# Altium schematic sheet PWR_0V9_20A.SchDoc: =ProjectName
size 420 x 297 mm; Author: T.P.; CompanyName: WUT; DrawnBy: T.P.; Organization: WUT ISE; Address1: Warsaw Univeristy of Technology; Address2: Nowowiejska 15/19; DocumentNumber: 28; Revision: 0.9; SheetNumber: 28; SheetTotal: 36; EDA_Number: ARTIQ; Projet: ARTIQ/SINARA; ModifiedBy: -; CreateDate: XX/XX/XXXX; CheckedDate: -; Title2: PWR_0V9_20A.SchDoc; DivGrp: ISE; Designer: G.K. and T.P.; ModifiedDate: -; ProjectName: ADC/DAC MEZZANINE
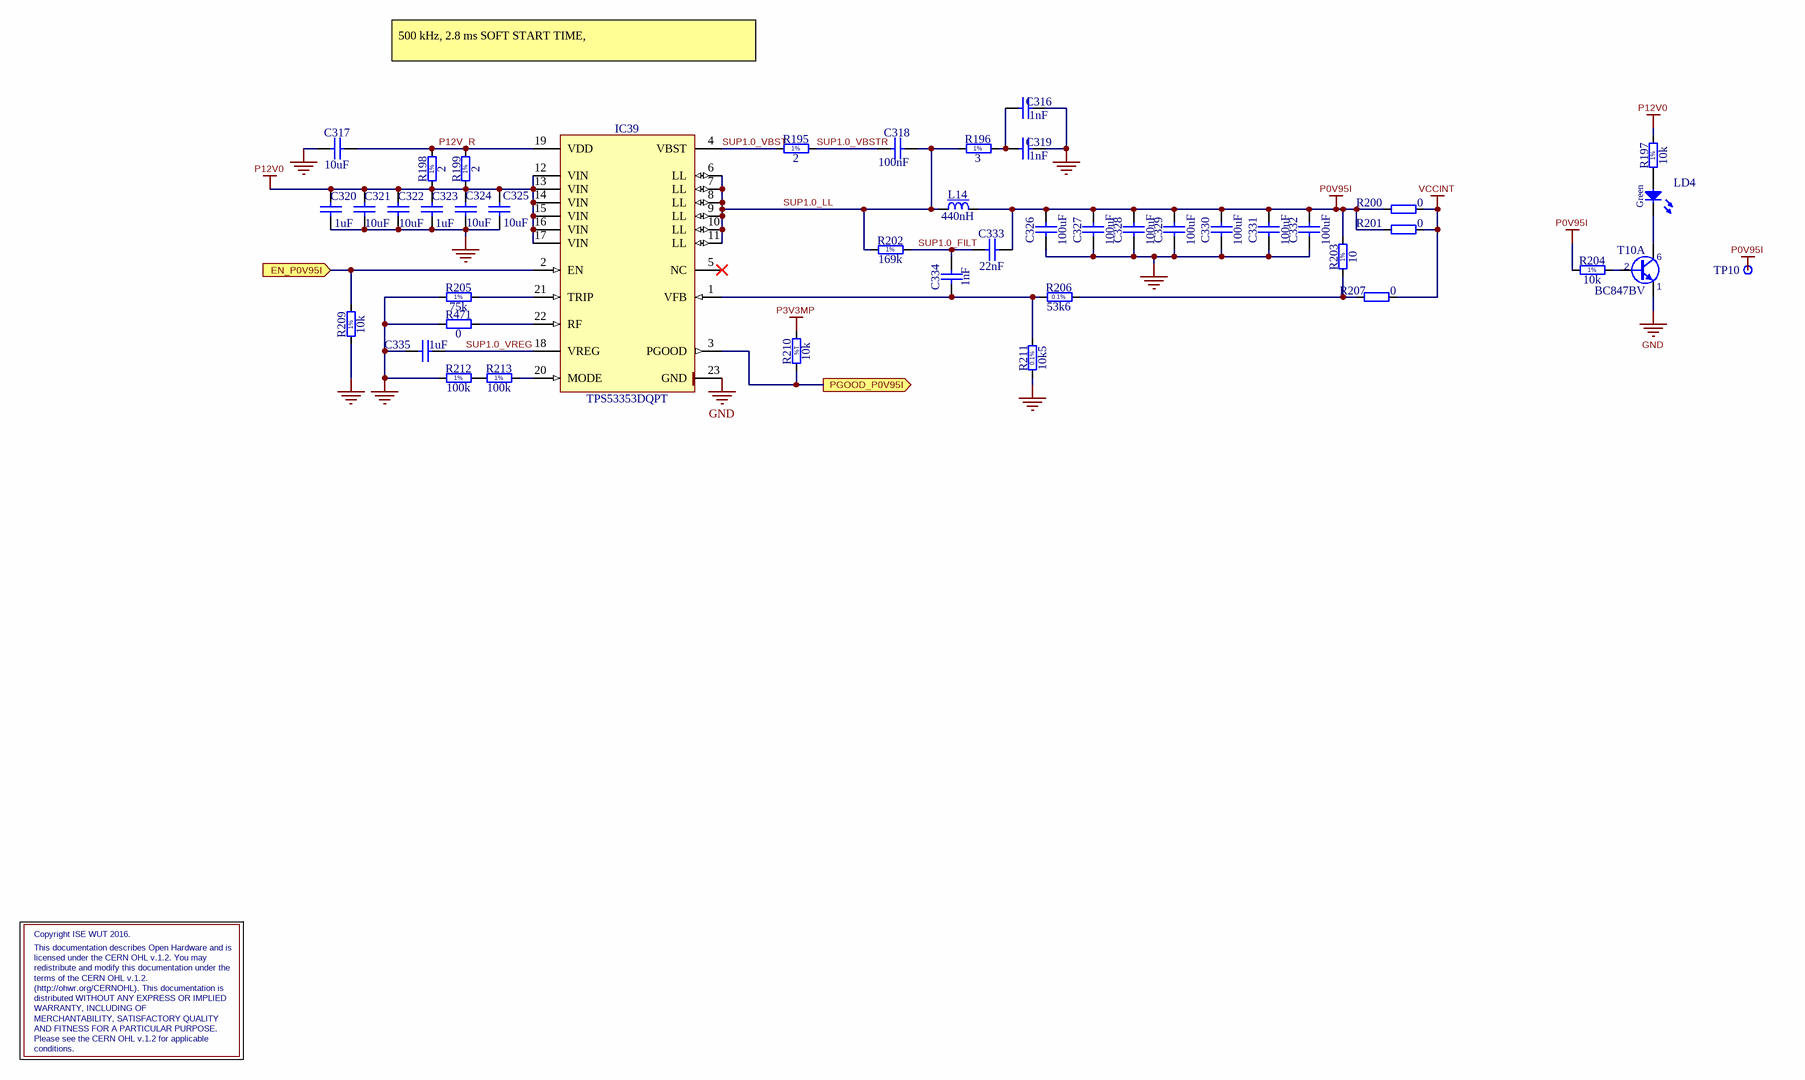
[diagram p0: PWR_0V9_20A.SchDoc]

## Parts
C316  1nF  [CAPC1005X55N]
C317  10uF  [CAPC3216X180N]
C318  100nF  [CAPC1005X55N]
C319  1nF  [CAPC1005X55N]
C320  1uF  [CAPC1608X87N]
C321  10uF  [CAPC3216X180N]
C322  10uF  [CAPC3216X180N]
C323  1uF  [CAPC1608X87N]
C324  10uF  [CAPC3216X180N]
C325  10uF  [CAPC3216X180N]
C326  100uF  [CAPC3216X180N]
C327  100uF  [CAPC3216X180N]
C328  100uF  [CAPC3216X180N]
C329  100uF  [CAPC3216X180N]
C330  100uF  [CAPC3216X180N]
C331  100uF  [CAPC3216X180N]
C332  100uF  [CAPC3216X180N]
C333  22nF  [CAPC1608X87N]
C334  1nF  [CAPC1005X55N]
C335  1uF  [CAPC1608X87N]
IC39  TPS53353DQPT  [SON50P500X600X150-23N-R334X557]
L14  440nH  [IND_PULSE_PA0513]
LD4  Green  [LED_OSRAM_LGL29K]
R195  2  [RESC1608X55N]
R196  3  [RESC3216X65N]
R197  10k  [RESC1005X40N]
R198  2  [RESC1608X55N]
R199  2  [RESC1608X55N]
R200  0  [RESC6331X70N]
R201  0  [RESC6331X70N]
R202  169k  [RESC1608X55N]
R203  10  [RESC1005X40N]
R204  10k  [RESC1005X40N]
R205  75k  [RESC1005X40N]
R206  53k6  [RESC1608X55N]
R207  0  [RESC6331X70N]
R209  10k  [RESC1005X40N]
R210  10k  [RESC1005X40N]
R211  10k5  [RESC1608X55N]
R212  100k  [RESC1005X40N]
R213  100k  [RESC1005X40N]
R471  0  [RESC1005X40N]
T10  BC847BV  [SOTFL50P160X60-6N]  (part A of 2)
TP10  Test Point  [TPS127]  (value not drawn)

## Ports
EN_P0V95I (in), PGOOD_P0V95I (out)

## Nets
GND: C316.2 C317.2 C319.2 C320.1 C321.1 C322.1 C323.1 C324.1 C325.1 C326.1 C327.1 C328.1 C329.1 C330.1 C331.1 C332.1 C335.2 IC39.23(GND) R205.1 R209.2 R211.1 R212.1 R471.1 T10.1(E)
P0V95I: C326.2 C327.2 C328.2 C329.2 C330.2 C331.2 C332.2 C333.2 L14.2 R200.1 R201.1 R203.2 R204.1 TP10.1
P3V3MP: R210.2
P12V0: C320.2 C321.2 C322.2 C323.2 C324.2 C325.2 IC39.12(VIN) IC39.13(VIN) IC39.14(VIN) IC39.15(VIN) IC39.16(VIN) IC39.17(VIN) R197.2 R198.1 R199.1
VCCINT: R200.2 R201.2 R207.2
EN_P0V95I: IC39.2(EN) R209.1 ; port EN_P0V95I
P12V_R: C317.1 IC39.19(VDD) R198.2 R199.2
PGOOD_P0V95I: IC39.3(PGOOD) R210.1 ; port PGOOD_P0V95I
SUP1.0_FILT: C333.1 C334.2 R202.2
SUP1.0_LL: C318.2 IC39.6(LL) IC39.7(LL) IC39.8(LL) IC39.9(LL) IC39.10(LL) IC39.11(LL) L14.1 R196.1 R202.1
SUP1.0_VBST: IC39.4(VBST) R195.1
SUP1.0_VBSTR: C318.1 R195.2
SUP1.0_VREG: C335.1 IC39.18(VREG)
NetC316_1: C316.1 C319.1 R196.2
NetC334_1: C334.1 IC39.1(VFB) R206.1 R211.2
NetIC39_20: IC39.20(MODE) R213.2
NetIC39_21: IC39.21(TRIP) R205.2
NetIC39_22: IC39.22(RF) R471.2
NetLD4_1: LD4.1(C) T10.6(C)
NetLD4_2: LD4.2(A) R197.1
NetR203_1: R203.1 R206.2 R207.1
NetR204_2: R204.2 T10.2(B)
NetR212_2: R212.2 R213.1

Not connected (* = marked no-connect by the designer): IC39 5(NC)*

## Notes on the sheet
- 500 kHz, 2.8 ms SOFT START TIME,
- Copyright ISE WUT 2016.
- (http://ohwr.org/CERNOHL). This documentation is
- distributed WITHOUT ANY EXPRESS OR IMPLIED
- This documentation describes Open Hardware and is
- terms of the CERN OHL v.1.2.
- licensed under the CERN OHL v.1.2. You may
- redistribute and modify this documentation under the
- conditions.
- AND FITNESS FOR A PARTICULAR PURPOSE.
- MERCHANTABILITY, SATISFACTORY QUALITY
- Please see the CERN OHL v.1.2 for applicable
- WARRANTY, INCLUDING OF
- Project/Equipment
- Document
- Designer
- Drawn by
- Check.by
- File
- Last Mod.
- Print Date
- Sheet
- Size
- A3
- of
- Rev
- (in symbol R0402_10K_1%_0.0625W_100PPM) 1%
- (in symbol R0402_10R_1%_0.0625W_200PPM) 1%
- (in symbol R0402_75K_1%_0.0625W_100PPM) 1%
- (in symbol R0402_100K_1%_0.0625W_100PPM) 1%
- (in symbol R0603_2R_1%_0.1W_200PPM) 1%
- (in symbol R0603_10K5_0.1%_0.063W_10PPM) 0.1%
- (in symbol R0603_53K6_0.1%_0.063W_10PPM) 0.1%
- (in symbol R0603_169K_1%_0.1W_100PPM) 1%
- (in symbol R1206_3R_1%_0.25W_200PPM) 1%

## Library data of the parts
C316 C319 C334 = CC0402_1NF_50V_10%_X7R: Non-polarised capacitor; Manufacturer: GENERIC; Part Description: SMD Multilayer Chip Ceramic Capacitor; Manufacturer1 Part Number: 223858715623; Tolerance: ±10%; Voltage: 50V; TC: X7R; Manufacturer Part Number: CC0402_1NF_50V_10%_X7R; Part Number: CC0402_1NF_50V_10%_X7R; Value: 1nF; Component Kind: Standard; Component Type: Standard; Pin Count: 2; Status: Not Recommended; Case: 0402; Mounted: Yes; Socket: No; SMD: Yes; Sense: No; Manufacturer1 Example: PHYCOMP; Manufacturer1 ComponentHeight: 0.55mm; HelpURL: \\cern.ch\dfs\Applications\Altium\Datasheets\CC0402_X7R_PHYCOMP.pdf; Author: CERN DEM JLC; CreateDate: 03.12.2007; LatestRevisionDate: 03.12.2007
C317 C321 C322 C324 C325 = CC1206_10uF_25V_10%_X7R: Non-polarised capacitor; Manufacturer: GENERIC; Part Description: SMD Multilayer Chip Ceramic Capacitor; Manufacturer1 Part Number: C1206C106K4RACTU; Tolerance: ±10%; Voltage: 25V; TC: X7R; Manufacturer Part Number: CC1206_10uF_25V_10%_X7R; Part Number: CC1206_10UF_25V_10%_X7R; Value: 10uF; Component Kind: Standard; Component Type: Standard; Pin Count: 2; Status: Preferred; Case: 1206; Mounted: Yes; Socket: No; SMD: Yes; Sense: No; Manufacturer1 Example: KEMET; Manufacturer1 ComponentHeight: 1.8mm; HelpURL: \\cern.ch\dfs\Applications\Altium\Datasheets\CC1206_X7R_KEMET.pdf; Author: CERN DEM JLC; CreateDate: 12.09.2012; LatestRevisionDate: 12.09.2012
C318 = CC0402_100NF_16V_10%_X5R: Non-polarised capacitor; Manufacturer: GENERIC; Part Description: SMD Multilayer Chip Ceramic Capacitor; Manufacturer1 Part Number: GRM155R61C104KA88D; Tolerance: ±10%; Voltage: 16V; TC: X5R; Manufacturer Part Number: CC0402_100NF_16V_10%_X5R; Part Number: CC0402_100NF_16V_10%_X5R; Value: 100nF; Component Kind: Standard; Component Type: Standard; Pin Count: 2; Status: None; Case: 0402; Mounted: Yes; Socket: No; SMD: Yes; Sense: No; Manufacturer1 Example: MURATA; Manufacturer1 ComponentHeight: 0.55mm; HelpURL: \\cern.ch\dfs\Applications\Altium\Datasheets\CC0402_X5R_MURATA_GRM.pdf; Author: CERN DEM JLC; CreateDate: 10.12.2013; LatestRevisionDate: 10.12.2013
C320 C323 C335 = CC0603_1UF_25V_10%_X7R: Non-polarised capacitor; Manufacturer: GENERIC; Part Description: SMD Multilayer Chip Ceramic Capacitor; Manufacturer1 Part Number: GRM188R71E105KA12D; Tolerance: ±10%; Voltage: 25V; TC: X7R; Manufacturer Part Number: CC0603_1UF_25V_10%_X7R; Part Number: CC0603_1UF_25V_10%_X7R; Value: 1uF; Component Kind: Standard; Component Type: Standard; Pin Count: 2; Status: None; Case: 0603; Mounted: Yes; Socket: No; SMD: Yes; Sense: No; Manufacturer1 Example: MURATA; Manufacturer1 ComponentHeight: 0.9mm; HelpURL: \\cern.ch\dfs\Applications\Altium\Datasheets\CC0603_X7R_MURATA.pdf; Author: CERN DEM JLC; CreateDate: 18.01.2011; LatestRevisionDate: 18.01.2011
C326-C332 = CC1206_100UF_6.3V_20%_X5R: Non-polarised capacitor; Manufacturer: GENERIC; Part Description: SMD Multilayer Chip Ceramic Capacitor; Manufacturer1 Part Number: C1206C107M9PACTU; Tolerance: ±10%; Voltage: 6.3V; TC: X5R; Manufacturer Part Number: CC1206_100UF_6.3V_20%_X5R; Part Number: CC1206_100UF_6.3V_20%_X5R; Value: 100uF; Component Kind: Standard; Component Type: Standard; Pin Count: 2; Status: None; Case: 1206; Mounted: Yes; Socket: No; SMD: Yes; Sense: No; Manufacturer1 Example: KEMET; Manufacturer1 ComponentHeight: 1.8mm; HelpURL: \\cern.ch\dfs\Applications\Altium\Datasheets\CC1206_X5R_KEMET.pdf; Author: CERN DEM JLC; CreateDate: 26.09.2012; LatestRevisionDate: 26.09.2012
C333 = CC0603_22NF_50V_10%_X7R: Non-polarised capacitor; Manufacturer: GENERIC; Part Description: SMD Multilayer Chip Ceramic Capacitor; Manufacturer1 Part Number: 223858615641; Tolerance: ±10%; Voltage: 50V; TC: X7R; Manufacturer Part Number: CC0603_22NF_50V_10%_X7R; Part Number: CC0603_22NF_50V_10%_X7R; Value: 22nF; Component Kind: Standard; Component Type: Standard; Pin Count: 2; Status: Preferred; Case: 0603; Mounted: Yes; Socket: No; SMD: Yes; Sense: No; Manufacturer1 Example: PHYCOMP; Manufacturer1 ComponentHeight: 0.87mm; HelpURL: \\cern.ch\dfs\Applications\Altium\Datasheets\CC0603_X7R_PHYCOMP.pdf; Author: CERN DEM JLC; CreateDate: 03.12.2007; LatestRevisionDate: 03.12.2007
IC39 = TPS53353DQPT: 1.5V to 15V Input (4.5V to 25V Bias), 20A Synchronous Buck SWIFT™ Converter with Eco-mode™; Manufacturer: TEXAS INSTRUMENTS; Autho: TP; PressFit: No; Bonding: No; Mounted: Yes; Part Number: TPS53353DQPT; Pin Count: 23; Socket: No; Sense: No; SMD: Yes; Case: SON22; Component Kind: Standard; Component Type: Standard; ComponentHeight: 1.5mm; CreateDate: 17.01.2019; Device: TPS53353DQPT; Manufacturer Part Number: TPS53353DQPT; PackageDescription: SON, 0.50mm Pitch; 22 Pin, 5.00mm W X 6.00mm L X 1.50mm H Body (w/Thermal Tab 3.34 X 5.57mm), IPC Medium Density; Part Description: 1.5V to 15V Input (4.5V to 25V Bias), 20A Synchronous Buck SWIFT™ Converter with Eco-mode™
L14 = IND_440NH_20%_PULSE_PA0513.441NLT: Inductor With Core; Manufacturer: PULSE ELECTRONICS; Part Description: SMT Power Inductor; Tolerance: ±20%; Power: 30A; Resistance: 0.0032R; Manufacturer Part Number: PA0513.441NLT; Part Number: IND_440NH_20%_PULSE_PA0513.441NLT; Value: 440nH; Component Kind: Standard; Component Type: Standard; Pin Count: 2; Status: None; Mounted: Yes; Socket: No; SMD: Yes; Sense: No; ComponentHeight: 8mm; HelpURL: \\cern.ch\dfs\Applications\Altium\Datasheets\IND_PULSE_PA0513.441NLT.pdf; Author: CERN DEM JLC; CreateDate: 15.11.2016; LatestRevisionDate: 15.11.2016
LD4 = LED_OSRAM_LG L29K-G2J1-24-Z: LED Green 1C 2A; Manufacturer: OSRAM; Part Description: Surface Mount Green LED (0603 Case); Bonding: No; PressFit: No; Status Comment: Sourcing Difficulty; Author: CERN DEM JLC; Case: 0603; Color: Green; Component Kind: Standard; Component Type: Standard; ComponentHeight: 0.67mm; CreateDate: 24.04.2012; HelpURL: \\cern.ch\dfs\Applications\Altium\Datasheets\LED_OSRAM_LGL29K.pdf; LatestRevisionDate: 24.04.2012; Manufacturer Part Number: LG L29K-G2J1-24-Z; Mounted: Yes; PackageDescription: Green Chip LED, 2-Leads, Body 1.7x0.8mm, IPC Medium Density; Part Number: LED_OSRAM_LG L29K-G2J1-24-Z; Pin Count: 2; SMD: Yes; Socket: No; Status: Not Recommended; Sense: No
R195 R198 R199 = R0603_2R_1%_0.1W_200PPM: Resistor - 1%; Manufacturer: GENERIC; Part Description: General Purpose Thick Film Chip Resistor; Manufacturer1 Part Number: 232270462008L or RC0603FR-072RL; Power: 0.1W; TC: ±200ppm/°C; PressFit: No; Manufacturer Part Number: R0603_2R_1%_0.1W_200PPM; Part Number: R0603_2R_1%_0.1W_200PPM; Tolerance: ±1%; Value: 2; Component Kind: Standard; Component Type: Standard; Pin Count: 2; Status: Preferred; Case: 0603; Mounted: Yes; Sense: No; Socket: No; SMD: Yes; Manufacturer1 Example: YAGEO PHYCOMP; Manufacturer1 ComponentHeight: 0.65mm; HelpURL: \\cern.ch\dfs\Applications\Altium\Datasheets\R0603_Tyco_RN73.pdf; Author: CERN DEM JLC; CreateDate: 03.12.2007; LatestRevisionDate: 17.10.2012
R196 = R1206_3R_1%_0.25W_200PPM: Resistor - 1%; Manufacturer: GENERIC; Part Description: General Purpose Thick Film Chip Resistor; Manufacturer1 Part Number: 232272463008; Power: 0.25W; TC: ±200ppm/°C; PressFit: No; Manufacturer Part Number: R1206_3R_1%_0.25W_200PPM; Part Number: R1206_3R_1%_0.25W_200PPM; Tolerance: ±1%; Value: 3; Component Kind: Standard; Component Type: Standard; Pin Count: 2; Status: Preferred; Case: 1206; Mounted: Yes; Sense: No; Socket: No; SMD: Yes; Manufacturer1 Example: PHYCOMP; Manufacturer1 ComponentHeight: 0.65mm; HelpURL: \\cern.ch\dfs\Applications\Altium\Datasheets\R1206_Phycomp_RC1206.pdf; Author: CERN DEM JLC; CreateDate: 03.12.2007; LatestRevisionDate: 24.06.2009
R197 = R0402_10K_1%_0.0625W_100PPM: Resistor - 1%; Part Description: General Purpose Thick Film Chip Resistor; Manufacturer: GENERIC; Manufacturer1 Part Number: 232270671003L; TC: ±100ppm/°C; PressFit: No; Part Number: R0402_10K_1%_0.0625W_100PPM; Component Kind: Standard; Component Type: Standard; Pin Count: 2; Value: 10k; Status: Not Recommended; Power: 0.0625W; Tolerance: ±1%; Manufacturer Part Number: R0402_10K_1%_0.0625W_100PPM; Case: 0402; Mounted: Yes; Sense: No; Socket: No; SMD: Yes; Manufacturer1 Example: YAGEO PHYCOMP; Manufacturer1 ComponentHeight: 0.4mm; HelpURL: \\cern.ch\dfs\Applications\Altium\Datasheets\R0402_Phycomp_RC0402.pdf; Author: CERN DEM JLC; CreateDate: 03.12.2007; LatestRevisionDate: 17.10.2012
R200 R201 R207 = R2512_0R_JUMPER: Resistor; Manufacturer: GENERIC; Part Description: 16A (0.005R Max DC Resistance) Zero Ohm Jumper; Manufacturer1 Part Number: CRCW25120000Z0EG; PressFit: No; Manufacturer Part Number: R2512_0R_JUMPER; Part Number: R2512_0R_JUMPER; Value: 0; Component Kind: Standard; Component Type: Standard; Pin Count: 2; Status: Preferred; Case: 2512; Mounted: Yes; Sense: No; Socket: No; SMD: Yes; Manufacturer1 Example: VISHAY DRALORIC; Manufacturer1 ComponentHeight: 0.7mm; HelpURL: \\cern.ch\dfs\Applications\Altium\Datasheets\R2512_VISHAY_CRCW-HP E3.pdf; Author: CERN DEM JLC; CreateDate: 17.09.2014; LatestRevisionDate: 17.09.2014
R202 = R0603_169K_1%_0.1W_100PPM: Resistor - 1%; Manufacturer: GENERIC; Part Description: General Purpose Thick Film Chip Resistor; Manufacturer1 Part Number: CRCW0603169KFKEA; Power: 0.1W; TC: ±100ppm/°C; PressFit: No; Manufacturer Part Number: R0603_169K_1%_0.1W_100PPM; Part Number: R0603_169k_1%_0.1W_100PPM; Tolerance: ±1%; Value: 169k; Component Kind: Standard; Component Type: Standard; Pin Count: 2; Status: Preferred; Case: 0603; Mounted: Yes; Sense: No; Socket: No; SMD: Yes; Manufacturer1 Example: VISHAY; Manufacturer1 ComponentHeight: 0.50mm; HelpURL: \\cern.ch\dfs\Applications\Altium\Datasheets\R0603_VISHAY_CRCW e3.pdf; Author: CERN DEM JLC; CreateDate: 17.03.2014; LatestRevisionDate: 17.03.2014
R203 = R0402_10R_1%_0.0625W_200PPM: Resistor - 1%; Manufacturer: GENERIC; Part Description: General Purpose Thick Film Chip Resistor; Manufacturer1 Part Number: 232270671009L; TC: ±200ppm/°C; PressFit: No; Manufacturer Part Number: R0402_10R_1%_0.0625W_200PPM; Part Number: R0402_10R_1%_0.0625W_200PPM; Tolerance: ±1%; Value: 10; Component Kind: Standard; Component Type: Standard; Pin Count: 2; Status: Not Recommended; Power: 0.0625W; Case: 0402; Mounted: Yes; Sense: No; Socket: No; SMD: Yes; Manufacturer1 Example: YAGEO PHYCOMP; Manufacturer1 ComponentHeight: 0.4mm; HelpURL: \\cern.ch\dfs\Applications\Altium\Datasheets\R0402_Phycomp_RC0402.pdf; Author: CERN DEM JLC; CreateDate: 24.06.2009; LatestRevisionDate: 17.10.2012
R204 R209 R210 = R0402_10K_1%_0.0625W_100PPM: Resistor - 1%; Manufacturer: GENERIC; Part Description: General Purpose Thick Film Chip Resistor; Manufacturer1 Part Number: 232270671003L; TC: ±100ppm/°C; PressFit: No; Manufacturer Part Number: R0402_10K_1%_0.0625W_100PPM; Part Number: R0402_10K_1%_0.0625W_100PPM; Tolerance: ±1%; Value: 10k; Component Kind: Standard; Component Type: Standard; Pin Count: 2; Status: Not Recommended; Power: 0.0625W; Case: 0402; Mounted: Yes; Sense: No; Socket: No; SMD: Yes; Manufacturer1 Example: YAGEO PHYCOMP; Manufacturer1 ComponentHeight: 0.4mm; HelpURL: \\cern.ch\dfs\Applications\Altium\Datasheets\R0402_Phycomp_RC0402.pdf; Author: CERN DEM JLC; CreateDate: 03.12.2007; LatestRevisionDate: 17.10.2012
R205 = R0402_75K_1%_0.0625W_100PPM: Resistor - 1%; Manufacturer: GENERIC; Part Description: General Purpose Thick Film Chip Resistor; Manufacturer1 Part Number: 232270677503L; TC: ±100ppm/°C; PressFit: No; Manufacturer Part Number: R0402_75K_1%_0.0625W_100PPM; Part Number: R0402_75K_1%_0.0625W_100PPM; Tolerance: ±1%; Value: 75k; Component Kind: Standard; Component Type: Standard; Pin Count: 2; Status: Not Recommended; Power: 0.0625W; Case: 0402; Mounted: Yes; Sense: No; Socket: No; SMD: Yes; Manufacturer1 Example: YAGEO PHYCOMP; Manufacturer1 ComponentHeight: 0.4mm; HelpURL: \\cern.ch\dfs\Applications\Altium\Datasheets\R0402_Phycomp_RC0402.pdf; Author: CERN DEM JLC; CreateDate: 03.12.2007; LatestRevisionDate: 17.10.2012
R206 = R0603_53K6_0.1%_0.063W_10PPM: Resistor - 0.1%; Part Description: Thin Film Chip Resistor; Manufacturer: GENERIC; Manufacturer1 Part Number: RN73C1J53K6BTDF; Power: 0.063W; TC: ±10ppm; PressFit: No; Part Number: R0603_53K6_0.1%_0.063W_10PPM; Component Kind: Standard; Component Type: Standard; Pin Count: 2; Value: 53k6; Status: Not Recommended; Tolerance: ±0.1%; Manufacturer Part Number: R0603_53K6_0.1%_0.063W_10PPM; Case: 0603; Mounted: Yes; Sense: No; Socket: No; SMD: Yes; Manufacturer1 Example: TYCO HOLSWORTHY; Manufacturer1 ComponentHeight: 0.5mm; HelpURL: \\cern.ch\dfs\Applications\Altium\Datasheets\R0603_Tyco_RN73.pdf; Author: CERN DEM JLC; CreateDate: 03.12.2007; LatestRevisionDate: 13.03.2008
R211 = R0603_10K5_0.1%_0.063W_10PPM: Resistor - 0.1%; Part Description: Thin Film Chip Resistor; Manufacturer: GENERIC; Manufacturer1 Part Number: RN73C1J10K5BTDF; Power: 0.063W; TC: ±10ppm; PressFit: No; Part Number: R0603_10K5_0.1%_0.063W_10PPM; Component Kind: Standard; Component Type: Standard; Pin Count: 2; Value: 10k5; Status: Not Recommended; Tolerance: ±0.1%; Manufacturer Part Number: R0603_10K5_0.1%_0.063W_10PPM; Case: 0603; Mounted: Yes; Sense: No; Socket: No; SMD: Yes; Manufacturer1 Example: TYCO HOLSWORTHY; Manufacturer1 ComponentHeight: 0.5mm; HelpURL: \\cern.ch\dfs\Applications\Altium\Datasheets\R0603_Tyco_RN73.pdf; Author: CERN DEM JLC; CreateDate: 03.12.2007; LatestRevisionDate: 13.03.2008
R212 R213 = R0402_100K_1%_0.0625W_100PPM: Resistor - 1%; Manufacturer: GENERIC; Part Description: General Purpose Thick Film Chip Resistor; Manufacturer1 Part Number: 232270671004L; TC: ±100ppm/°C; PressFit: No; Manufacturer Part Number: R0402_100K_1%_0.0625W_100PPM; Part Number: R0402_100K_1%_0.0625W_100PPM; Tolerance: ±1%; Value: 100k; Component Kind: Standard; Component Type: Standard; Pin Count: 2; Status: Not Recommended; Power: 0.0625W; Case: 0402; Mounted: Yes; Sense: No; Socket: No; SMD: Yes; Manufacturer1 Example: YAGEO PHYCOMP; Manufacturer1 ComponentHeight: 0.4mm; HelpURL: \\cern.ch\dfs\Applications\Altium\Datasheets\R0402_Phycomp_RC0402.pdf; Author: CERN DEM JLC; CreateDate: 03.12.2007; LatestRevisionDate: 17.10.2012
R471 = R0402_0R_JUMPER: Resistor; Part Description: 1A (0.05R Max DC Resistance) Zero Ohm Jumper; Manufacturer: GENERIC; Manufacturer1 Part Number: 232270591001L; PressFit: No; Part Number: R0402_0R_JUMPER; Component Kind: Standard; Component Type: Standard; Pin Count: 2; Value: 0; Status: Not Recommended; Manufacturer Part Number: R0402_0R_JUMPER; Case: 0402; Mounted: Yes; Sense: No; Socket: No; SMD: Yes; Manufacturer1 Example: YAGEO PHYCOMP; Manufacturer1 ComponentHeight: 0.4mm; HelpURL: \\cern.ch\dfs\Applications\Altium\Datasheets\R0402_Phycomp_RC0402.pdf; Author: CERN DEM JLC; CreateDate: 03.12.2007; LatestRevisionDate: 17.10.2012
T10 = BC847BV: 45V, 100mA NPN General Purpose Double Transistor; Manufacturer: NXP SEMICONDUCTORS; Part Description: 45V 100mA NPN General Purpose Double Transistor; PressFit: No; Bonding: No; Manufacturer Part Number: BC847BV; PackageDescription: SOTFL (SOT666), 0.50mm, Pitch; 6 Pin, 1.20mm W X 1.60mm L X 0.60mm H Body, IPC Medium Density; Part Number: BC847BV; Component Kind: Standard; Component Type: Standard; Device: BC847BV; Pin Count: 6; Case: SOT666; Mounted: Yes; Socket: No; SMD: Yes; Sense: No; ComponentHeight: 0.6mm; HelpURL: \\cern.ch\dfs\Applications\Altium\Datasheets\BC847BV.pdf; Author: CERN DEM JLC; CreateDate: 01.12.2011; LatestRevisionDate: 01.12.2011
TP10 = SMD_PAD_1.27X1.27MM: Part Description: 1.27mm x 1.27mm PCB Copper Area (SMD Test Point); Mounted: No; Part Number: SMD_PAD_1.27X1.27MM; Component Kind: Standard (No BOM); Component Type: Standard (No BOM); Pin Count: 1; Family: Test Point; Socket: No; SMD: Yes; Sense: No; Status: None; ComponentHeight: 0mm; HelpURL: Undefined; Author: CERN DEM JLC; CreateDate: 12.01.2008; LatestRevisionDate: 12.01.2008; PackageDescription: 1.27mm x 1.27mm PCB Copper Area (SMD Test Point)